# Altium schematic sheet project_1.SchDoc
size A4; SheetNumber: 1; SheetTotal: 1
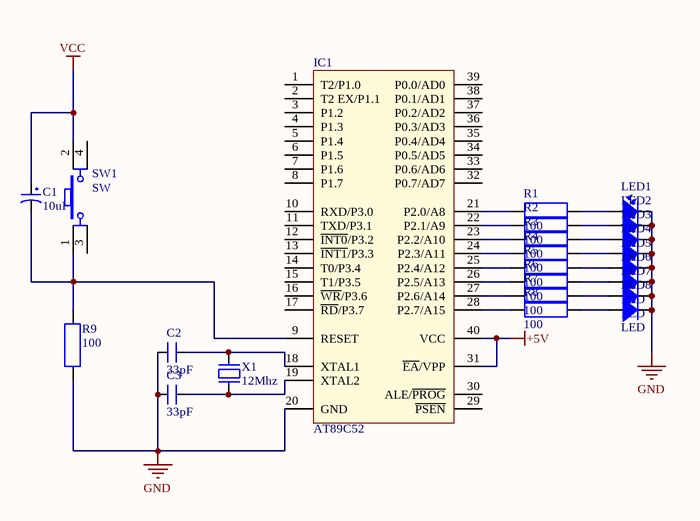
[diagram p0: project_1.SchDoc]

## Parts
C1  10uF  [CP1/2]
C2  33pF  [CN1.5]
C3  33pF  [CN1.5]
IC1  AT89C52  [DIP40/W0.6]
LED1  LED  [LED-3]
LED2  LED  [LED-3]
LED3  LED  [LED-3]
LED4  LED  [LED-3]
LED5  LED  [LED-3]
LED6  LED  [LED-3]
LED7  LED  [LED-3]
LED8  LED  [LED-3]
R1  100  [R1W]
R2  100  [R1W]
R3  100  [R1W]
R4  100  [R1W]
R5  100  [R1W]
R6  100  [R1W]
R7  100  [R1W]
R8  100  [R1W]
R9  100  [R1W]
SW1  SW  [SW4]
X1  12Mhz  [XT32k]

## Nets
+5V: IC1.31(~{EA}/VPP) IC1.40(VCC)
GND: C2.1 C3.1 IC1.20(GND) LED1.2 LED2.2 LED3.2 LED4.2 LED5.2 LED6.2 LED7.2 LED8.2 R9.1
VCC: C1.1 SW1.2
NetC1_2: C1.2 IC1.9(RESET) R9.2 SW1.1
NetC2_2: C2.2 IC1.18(XTAL1) X1.2
NetC3_2: C3.2 IC1.19(XTAL2) X1.1
NetIC1_21: IC1.21(P2.0/A8) R1.1
NetIC1_22: IC1.22(P2.1/A9) R2.1
NetIC1_23: IC1.23(P2.2/A10) R3.1
NetIC1_24: IC1.24(P2.3/A11) R4.1
NetIC1_25: IC1.25(P2.4/A12) R5.1
NetIC1_26: IC1.26(P2.5/A13) R6.1
NetIC1_27: IC1.27(P2.6/A14) R7.1
NetIC1_28: IC1.28(P2.7/A15) R8.1
NetLED1_1: LED1.1 R1.2
NetLED2_1: LED2.1 R2.2
NetLED3_1: LED3.1 R3.2
NetLED4_1: LED4.1 R4.2
NetLED5_1: LED5.1 R5.2
NetLED6_1: LED6.1 R6.2
NetLED7_1: LED7.1 R7.2
NetLED8_1: LED8.1 R8.2

Not connected (* = marked no-connect by the designer): IC1 1(T2/P1.0) 2(T2_EX/P1.1) 3(P1.2) 4(P1.3) 5(P1.4) 6(P1.5) 7(P1.6) 8(P1.7) 10(RXD/P3.0) 11(TXD/P3.1) 12(~{INT0}/P3.2) 13(~{INT1}/P3.3) 14(T0/P3.4) 15(T1/P3.5) 16(~{WR}/P3.6) 17(~{RD}/P3.7) 29(~{PSEN}) 30(ALE/~{PROG}) 32(P0.7/AD7) 33(P0.6/AD6) 34(P0.5/AD5) 35(P0.4/AD4) 36(P0.3/AD3) 37(P0.2/AD2) 38(P0.1/AD1) 39(P0.0/AD0); SW1 3 4

## Library data of the parts
C1 = CP1: Cap P  0,1uF < 22uF , 16 - 50V; Value: 10uF/50V; Description 1: 10 => 220uF/6,3V/10V - 10uF => 100uF/16V; Description 2: 0,1uF => 33uF/50V - 10uF => 22uF/63V; Description 3: 0,47uF => 10uF/100V
C2 C3 = CN1.5: Cap np 682pF => 104pF; Value: 0.01uF
IC1 = AT89C52: Atmel AT89C52, 8k Byte Flash Memory , 40 Pin; Value: AT89C52
LED1-LED8 = LED: LED Single colour Green and Red; Value: LED 3 ly Single Colour
R1-R9 = R1W: Resistor 1W; Value: R1W - 100
SW1 = SW4: Switch button 4 pin; Value: Button chip 4 pin
X1 = XT32k: Crystal 32,768kHz for timer real; Value: 32,768khz